# EAGLE schematic sa_psu (EAGLE 9.5.1)
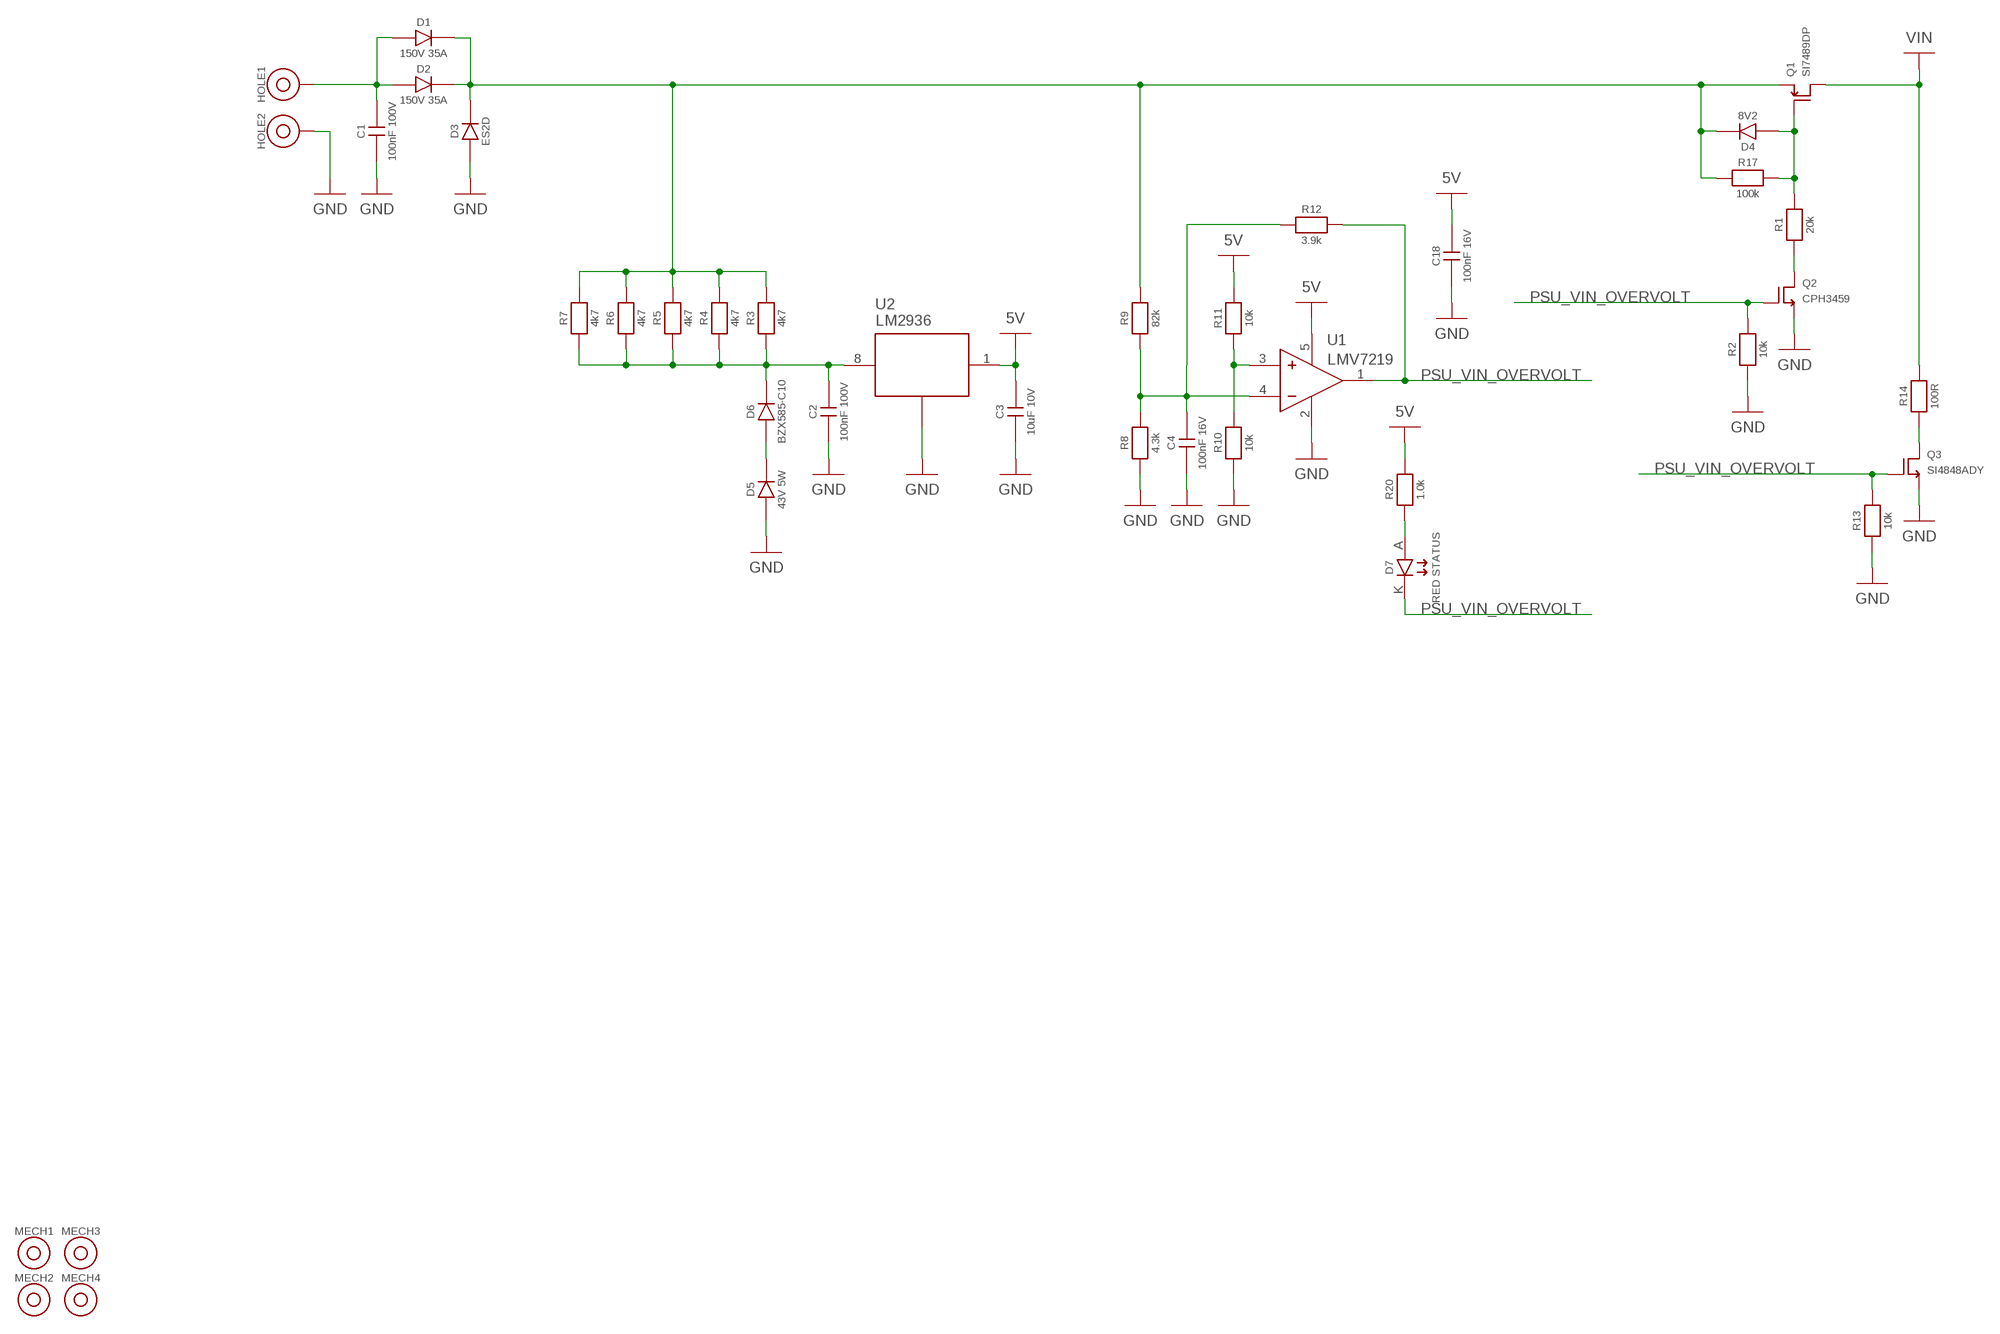
[diagram p0: schematic, sheet 1, part 1 of 2]
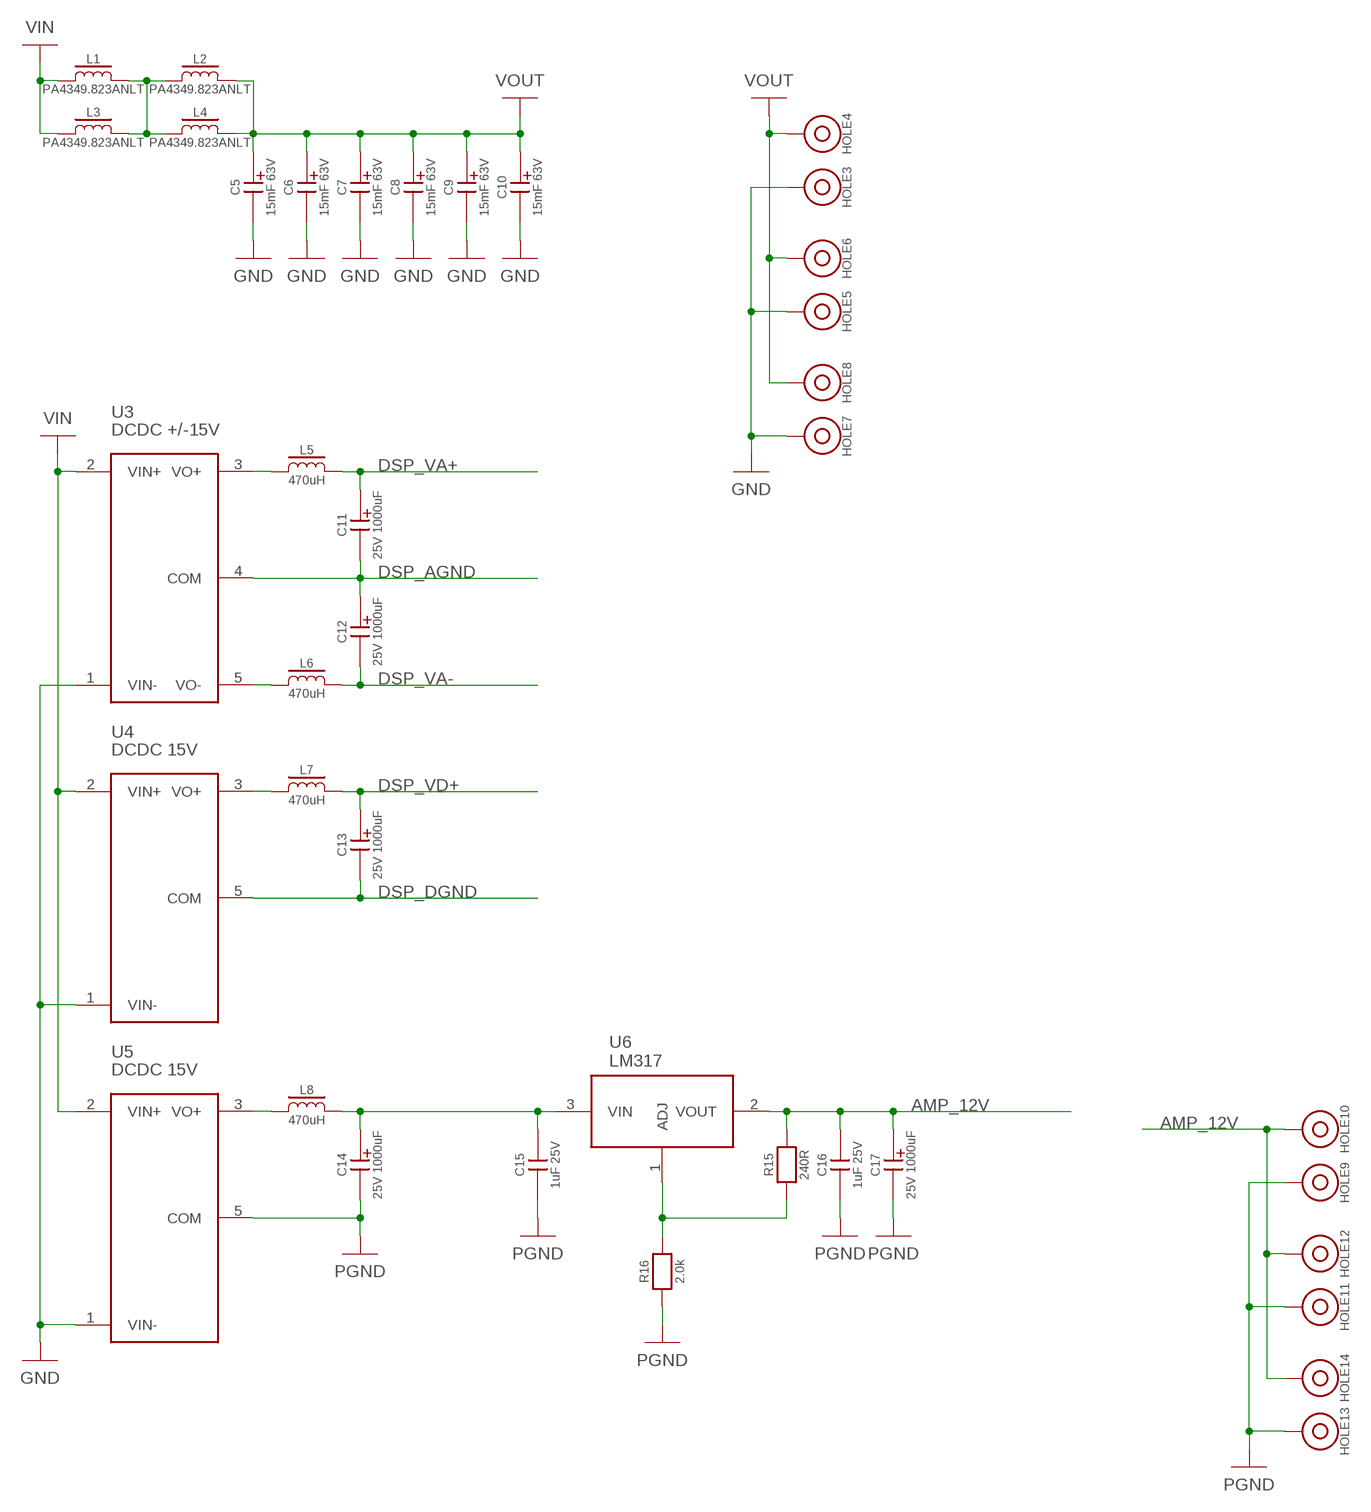
[diagram p1: schematic, sheet 1, part 2 of 2]

## Parts
C1  100nF 100V  06031C104KAT2A  [0603]
C2  100nF 100V  06031C104KAT2A  [0603]
C3  10uF 10V  GRM188R61A106KE69D  [0603]
C4  100nF 16V  CL10B104KO8WPNC  [0603]
C5  15mF 63V  C_ELEC35MM  [35MM/10MMCAP]
C6  15mF 63V  C_ELEC35MM  [35MM/10MMCAP]
C7  15mF 63V  C_ELEC35MM  [35MM/10MMCAP]
C8  15mF 63V  C_ELEC35MM  [35MM/10MMCAP]
C9  15mF 63V  C_ELEC35MM  [35MM/10MMCAP]
C10  15mF 63V  C_ELEC35MM  [35MM/10MMCAP]
C11  25V 1000uF  25ZLJ1000M10X20  [10MM_RADIAL_5MM_PITCH]
C12  25V 1000uF  25ZLJ1000M10X20  [10MM_RADIAL_5MM_PITCH]
C13  25V 1000uF  25ZLJ1000M10X20  [10MM_RADIAL_5MM_PITCH]
C14  25V 1000uF  25ZLJ1000M10X20  [10MM_RADIAL_5MM_PITCH]
C15  1uF 25V  CL10A105KA8NNNC  [0603]
C16  1uF 25V  CL10A105KA8NNNC  [0603]
C17  25V 1000uF  25ZLJ1000M10X20  [10MM_RADIAL_5MM_PITCH]
C18  100nF 16V  CL10B104KO8WPNC  [0603]
D1  150V 35A  V35PW15-M3/I  [TO252]
D2  150V 35A  V35PW15-M3/I  [TO252]
D3  ES2D  [DO214AA]
D4  8V2  BZT55C8V2  [SOD80]
D5  43V 5W  1N5367BG  [017AA-01]
D6  BZX585-C10  [SOD_523]
D7  RED STATUS  VLMT3100-GS08  [VLMT3100]
HOLE1  4mm ID  MOUNTHOLE_METAL  [MOUNTHOLE_8X4]
HOLE2  4mm ID  MOUNTHOLE_METAL  [MOUNTHOLE_8X4]
HOLE3  4mm ID  MOUNTHOLE_METAL  [MOUNTHOLE_8X4]
HOLE4  4mm ID  MOUNTHOLE_METAL  [MOUNTHOLE_8X4]
HOLE5  4mm ID  MOUNTHOLE_METAL  [MOUNTHOLE_8X4]
HOLE6  4mm ID  MOUNTHOLE_METAL  [MOUNTHOLE_8X4]
HOLE7  4mm ID  MOUNTHOLE_METAL  [MOUNTHOLE_8X4]
HOLE8  4mm ID  MOUNTHOLE_METAL  [MOUNTHOLE_8X4]
HOLE9  MOUNTHOLE_METAL4X2  [4X2]
HOLE10  MOUNTHOLE_METAL4X2  [4X2]
HOLE11  MOUNTHOLE_METAL4X2  [4X2]
HOLE12  MOUNTHOLE_METAL4X2  [4X2]
HOLE13  MOUNTHOLE_METAL4X2  [4X2]
HOLE14  MOUNTHOLE_METAL4X2  [4X2]
L1  PA4349.823ANLT  [PA4349.ZZZANLT]
L2  PA4349.823ANLT  [PA4349.ZZZANLT]
L3  PA4349.823ANLT  [PA4349.ZZZANLT]
L4  PA4349.823ANLT  [PA4349.ZZZANLT]
L5  470uH  SRN1060-471M  [SRN1060]
L6  470uH  SRN1060-471M  [SRN1060]
L7  470uH  SRN1060-471M  [SRN1060]
L8  470uH  SRN1060-471M  [SRN1060]
MECH1  6mm x 3mm  MOUNTHOLE  [MOUNTHOLE_6X3]
MECH2  6mm x 3mm  MOUNTHOLE  [MOUNTHOLE_6X3]
MECH3  6mm x 3mm  MOUNTHOLE  [MOUNTHOLE_6X3]
MECH4  6mm x 3mm  MOUNTHOLE  [MOUNTHOLE_6X3]
Q1  SI7489DP  SI7489DP-T1-E3  [SO8_POWERPAK]
Q2  CPH3459  CPH3459-TL-W  [SOT23-3]
Q3  SI4848ADY  SI4848ADY-T1-GE3  [SO8]
R1  20k  ERJ3EKF2002V  [0603]
R2  10k  ERJ3EKF1002V  [0603]
R3  4k7  CRCW12064K70FKEAHP  [1206]
R4  4k7  CRCW12064K70FKEAHP  [1206]
R5  4k7  CRCW12064K70FKEAHP  [1206]
R6  4k7  CRCW12064K70FKEAHP  [1206]
R7  4k7  CRCW12064K70FKEAHP  [1206]
R8  4.3k  ERJ3EKF4301V  [0603]
R9  82k  ERJ3EKF8202V  [0603]
R10  10k  ERJ3EKF1002V  [0603]
R11  10k  ERJ3EKF1002V  [0603]
R12  3.9k  ERJ3EKF3901V  [0603]
R13  10k  ERJ3EKF1002V  [0603]
R14  100R  ERG-3SJ101V  [15MM_TH]
R15  240R  ERJ3EKF2400V  [0603]
R16  2.0k  ERJ3EKF2001V  [0603]
R17  100k  ERJ3EKF1003V  [0603]
R20  1.0k  ERJ3EKF1001V  [0603]
U1  LMV7219  LMV7219M5/NOPB  [SOT23-5]
U2  LM2936  LM2936HVMAX  [SO8]
U3  DCDC +/-15V  PDQE10-Q48-D15-D  [PDQE10]
U4  DCDC 15V  PDQE10-Q48-S15  [PDQE10]
U5  DCDC 15V  PDQE10-Q48-S15  [PDQE10]
U6  LM317  LM317T  [TO220]

## Nets
5V: C3.2 C18.2 R11.2 R20.2 U1.5(VCC) U2.1(VOUT)
AMP_12V: C16.2 C17.2(A) HOLE10.1 HOLE12.1 HOLE14.1 R15.2 U6.2(VOUT)
DSP_AGND: C11.1(K) C12.2(A) U3.4(COM)
DSP_DGND: C13.1(K) U4.5(COM)
DSP_VA+: C11.2(A) L5.2
DSP_VA-: C12.1(K) L6.2
DSP_VD+: C13.2(A) L7.2
GND: C1.1 C2.1 C3.1 C4.1 C5.P$2 C6.P$2 C7.P$2 C8.P$2 C9.P$2 C10.P$2 C18.1 D3.A D5.A HOLE2.1 HOLE3.1 HOLE5.1 HOLE7.1 Q2.3(S) Q3.1(S) Q3.2(S) Q3.3(S) R2.1 R8.1 R10.1 R13.1 U1.2(GND) U2.2(GND) U2.3(GND) U2.6(GND) U2.7(GND) U3.1(VIN-) U4.1(VIN-) U5.1(VIN-)
N$1: C1.2 D1.1(A) D1.3(A) D2.1(A) D2.3(A) HOLE1.1
N$2: C4.2 R8.2 R9.1 R12.1 U1.4(-)
N$3: D4.A Q1.4(G) R1.2 R17.2
N$4: L1.2 L2.1 L3.2 L4.1
N$5: Q2.2(D) R1.1
N$6: D5.K D6.A
N$7: C2.2 D6.K R3.1 R4.1 R5.1 R6.1 R7.1 U2.8(VIN)
N$8: D1.4(K) D2.4(K) D3.K D4.K Q1.1(S) Q1.2(S) Q1.3(S) R3.2 R4.2 R5.2 R6.2 R7.2 R9.2 R17.1
N$9: R10.2 R11.1 U1.3(+)
N$11: D7.A R20.1
N$12: L5.1 U3.3(VO+)
N$13: L6.1 U3.5(VO-)
N$14: R15.1 R16.2 U6.1(ADJ)
N$18: C14.2(A) C15.2 L8.2 U6.3(VIN)
N$20: L8.1 U5.3(VO+)
N$22: L7.1 U4.3(VO+)
N$23: Q3.5(D) Q3.6(D) Q3.7(D) Q3.8(D) R14.1
PGND: C14.1(K) C15.1 C16.1 C17.1(K) HOLE9.1 HOLE11.1 HOLE13.1 R16.1 U5.5(COM)
PSU_VIN_OVERVOLT: D7.K Q2.1(G) Q3.4(G) R2.2 R12.2 R13.2 U1.1(VOUT)
VIN: L1.1 L3.1 Q1.5(D) Q1.6(D) Q1.7(D) Q1.8(D) Q1.PAD(D) R14.2 U3.2(VIN+) U4.2(VIN+) U5.2(VIN+)
VOUT: C5.P$1 C6.P$1 C7.P$1 C8.P$1 C9.P$1 C10.P$1 HOLE4.1 HOLE6.1 HOLE8.1 L2.2 L4.2

## Library data of the parts
C1 C2 = CAPACITORS:06031C104KAT2A: 100nF 100V X7R 10% 0603 MLCC.; DIGIKEY: 478-10047-1-ND; HEIGHT: 1; PRICE_PER: 0.14
C3 = CAPACITORS:GRM188R61A106KE69D: 10uF 10V X5R 10% 0603 MLCC.; DIGIKEY: 490-10474-1-ND; HEIGHT: 0.95; PRICE_PER: 0.17
C4 C18 = CAPACITORS:CL10B104KO8WPNC: 100nF 16V X7R 10% 0603 MLCC; DIGIKEY: 1276-6582-1-ND; HEIGHT: 1; PRICE_PER: 0.08
C5-C10 = PASSIVES:C_ELEC
C11-C14 C17 = CAPACITORS:25ZLJ1000M10X20: 1000uF 25V Electrolytic 20% d = 10mm h = 20mm radial; DIGIKEY: 1189-1245-ND; HEIGHT: 22; PRICE_PER: 0.53
C15 C16 = CAPACITORS:CL10A105KA8NNNC: 1uF 25V X5R 10% 0603 MLCC.; DIGIKEY: 1276-1102-1-ND; HEIGHT: 1; PRICE_PER: 0.08
D1 D2 = DIODES:V35PW15-M3/I: Diode Schottky 150V 35A Surface Mount SlimDPAK; DIGIKEY: V35PW15-M3/IGICT-ND; HEIGHT: 3; PRICE_PER: 0.97
D3 = DIODES:ES2D: Ultrafast Diode, Single, 200 V, 2 A, 900 mV, 20 ns, 50 A; DIGIKEY: ES2DFSCT-ND; HEIGHT: 2.5; PRICE_PER: 0.32
D4 = DIODES:BZT55C8V2: Zener Single Diode, 8.2 V, 500 mW, SOD-80 (MiniMELF), 5 %, 2 Pins, 175 °C; DIGIKEY: BZT55C8V2-GS08GICT-ND; HEIGHT: 2; PRICE_PER: 0.16
D5 = DIODES:1N5367BG: Zener Single Diode, 43 V, 5 W, 017AA, 5 %, 2 Pins, 200 °C; FARNELL: 9558241; PRICE_PER: 0.323
D6 = DIODES:BZX585-C10: Zener Single Diode, 10 V, 300 mW, SOD-523, 2, 150 °C; FARNELL: 1907632; PRICE_PER: 0.08
D7 = OPTO:VLMT3100-GS08: LED, Red, SMD, 2 mA, 2.2 V, 625 nm; DIGIKEY: VLMT3100-GS08CT-ND; HEIGHT: 2; PRICE_PER: 0.225
HOLE1-HOLE8 = MISC:MOUNTHOLE_METAL: Mount hole with connection.; PRICE_PER: 0
HOLE9-HOLE14 = MISC:MOUNTHOLE_METAL: Mount hole with connection.
L1-L4 = INDUCTORS:PA4349.823ANLT: 82µH Shielded Molded Inductor 12A 34.2mOhm Max Nonstandard
L5-L8 = INDUCTORS:SRN1060-471M: 470µH Semi-Shielded Wirewound Inductor 800mA 950 mOhm Max Nonstandard; DIGIKEY: SRN1060-471MCT-ND; HEIGHT: 6; PRICE_PER: 0.72
MECH1-MECH4 = MISC:MOUNTHOLE: Mechanical mounting hole.
Q1 = TRANSISTORs:SI7489DP-T1-E3: P Channel, -28A, -100V, 0.033 ohm, -10V, -3V; DIGIKEY: SI7489DP-T1-E3CT-ND; HEIGHT: 2; PRICE_PER: 2.16
Q2 = TRANSISTORs:CPH3459: N-Channel 200V 500mA (Ta) 1W (Ta) Surface Mount 3-CPH; DIGIKEY: CPH3459-TL-WOSCT-ND; HEIGHT: 1.2; PRICE_PER: 0.4
Q3 = TRANSISTORs:SI4848ADY-T1-GE3: N-Channel 150V 5.5A (Tc) 5W (Tc) Surface Mount 8-SOIC; DIGIKEY: SI4848ADY-T1-GE3CT-ND; HEIGHT: 2; PRICE_PER: 0.61
R1 = r_0603:ERJ3EKF2002V: 20000 20k 0603 0.1W 1% thick film resistor.; DIGIKEY: P20.0KHCT-ND; PRICE_PER: 0.10000
R2 R10 R11 R13 = r_0603:ERJ3EKF1002V: 10000 10k 0603 0.1W 1% thick film resistor.; DIGIKEY: P10.0KHCT-ND; PRICE_PER: 0.10000
R3-R7 = RESISTORS:CRCW12064K70FKEAHP: 4700 4k70 1206 0.5W 1% thick film resistor; FARNELL: 1739021; HEIGHT: 0.65; PRICE_PER: 0.1706
R8 = r_0603:ERJ3EKF4301V: 4300 4.3k 0603 0.1W 1% thick film resistor.; DIGIKEY: P4.30KHCT-ND; PRICE_PER: 0.10000
R9 = r_0603:ERJ3EKF8202V: 82000 82k 0603 0.1W 1% thick film resistor.; DIGIKEY: P82.0KHCT-ND; PRICE_PER: 0.10000
R12 = r_0603:ERJ3EKF3901V: 3900 3.9k 0603 0.1W 1% thick film resistor.; DIGIKEY: P3.90KHCT-ND; PRICE_PER: 0.10000
R14 = RESISTORS:ERG-3SJ101V: 100 TH 100R 15mm TH 3W 5% thick film resistor.; DIGIKEY: P100W-3CT-ND; HEIGHT: 5; PRICE_PER: 0.38
R15 = r_0603:ERJ3EKF2400V: 240 240R 0603 0.1W 1% thick film resistor.; DIGIKEY: P240HCT-ND; PRICE_PER: 0.10000
R16 = r_0603:ERJ3EKF2001V: 2000 2.0k 0603 0.1W 1% thick film resistor.; DIGIKEY: P2.00KHCT-ND; PRICE_PER: 0.10000
R17 = r_0603:ERJ3EKF1003V: 100000 100k 0603 0.1W 1% thick film resistor.; DIGIKEY: P100KHCT-ND; PRICE_PER: 0.10000
R20 = r_0603:ERJ3EKF1001V: 1000 1.0k 0603 0.1W 1% thick film resistor.; DIGIKEY: P1.00KHCT-ND; PRICE_PER: 0.10000
U1 = ICs:LMV7219: LMV7219 7-ns 2.7-V to 5-V Comparator with Rail-to-Rail Output; DIGIKEY: LMV7219M5/NOPBCT-ND; HEIGHT: 1.2; PRICE_PER: 1.96
U2 = ICs:LM2936HVMAX: Linear Voltage Regulator IC Positive Fixed 1 Output 5V 50mA 8-SOIC; DIGIKEY: LM2936HVMAX-5.0/NOPBCT-ND; HEIGHT: 1.5; PRICE_PER: 1.56
U3 = ICs:PDQE10-Q48-D15-D: Isolated Module DC DC Converter 2 Output 15V -15V 333mA, 333mA 18V - 75V Input; DIGIKEY: 102-4868-ND; HEIGHT: 12; PRICE_PER: 13.64
U4 U5 = ICs:PDQE10-Q48-S15: Isolated Module DC DC Converter 1 Output 15V 667mA 18V - 75V Input; DIGIKEY: PDQE10-Q48-S15-D; HEIGHT: 12; PRICE_PER: 12.18
U6 = ICs:LM317: Linear Voltage Regulator, Adjustable, 38V primary input, 1.2V to 32V/100 mA/1 Output; DIGIKEY: 497-1575-5-ND; HEIGHT: 19; PRICE_PER: 0.5